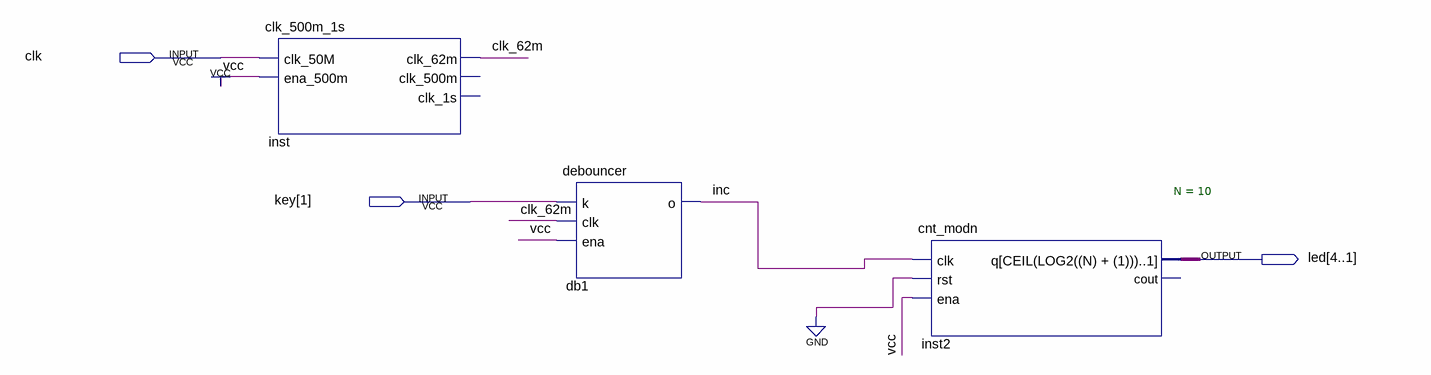
[diagram p0: schematic sheet]
// Quartus schematic test_up_down.bdf as structural Verilog: 3 symbols, 3 pins
module test_up_down (
  input  clk,
  input  [1:1] key,
  output [4:1] led
);

  wire clk_62m, inc;

  clk_500m_1s inst (.clk_50M(clk), .ena_500m(1'b1), .clk_62m(clk_62m));  // open: clk_500m, clk_1s
  debouncer db1 (.k(key[1]), .clk(clk_62m), .ena(1'b1), .o(inc));
  cnt_modn #(.N(10)) inst2 (.clk(inc), .rst(1'b0), .ena(1'b1), .q(led));  // open: cout
endmodule
